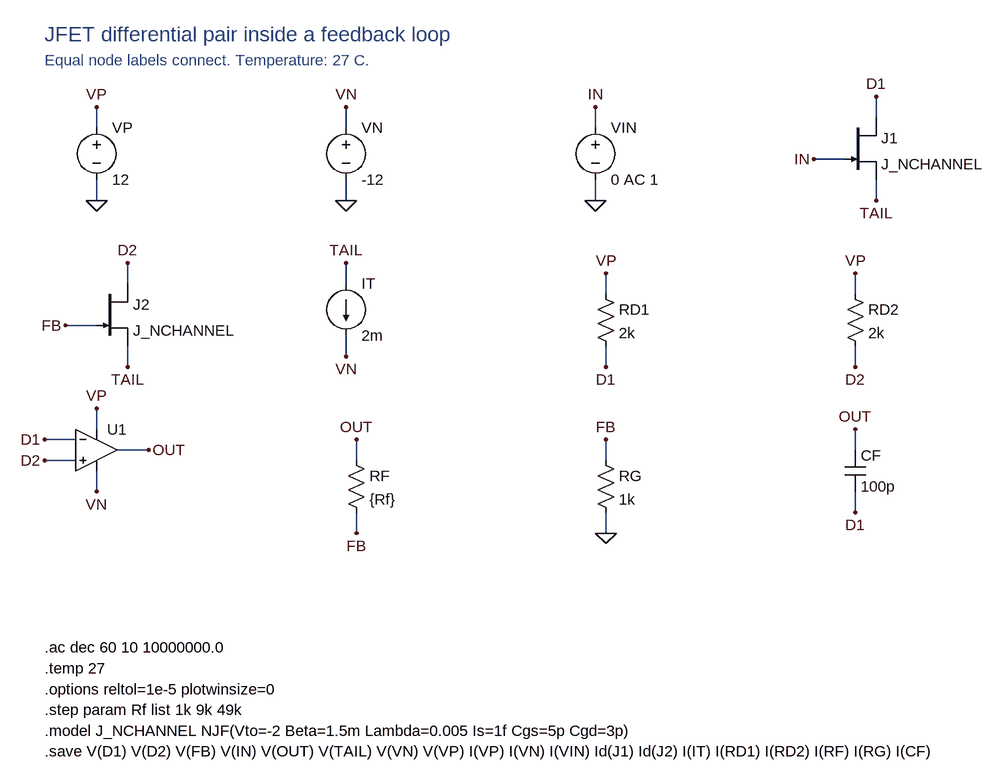
[diagram p0: schematic jfet-pair-feedback.asc]
jfet-pair-feedback.asc, the LTspice schematic file:
Version 4
SHEET 1 1740 1288
WIRE 144 176 144 144
WIRE 144 256 144 288
WIRE 528 176 528 144
WIRE 528 256 528 288
WIRE 912 176 912 144
WIRE 912 256 912 288
WIRE 1344 160 1344 128
WIRE 1296 224 1248 224
WIRE 1344 256 1344 288
WIRE 192 416 192 384
WIRE 144 480 96 480
WIRE 192 512 192 544
WIRE 528 416 528 384
WIRE 528 496 528 528
WIRE 928 432 928 400
WIRE 928 512 928 544
WIRE 1312 432 1312 400
WIRE 1312 512 1312 544
WIRE 112 688 64 688
WIRE 112 656 64 656
WIRE 144 640 144 608
WIRE 144 704 144 736
WIRE 176 672 224 672
WIRE 544 688 544 656
WIRE 544 768 544 800
WIRE 928 688 928 656
WIRE 928 768 928 800
WIRE 1312 672 1312 640
WIRE 1312 736 1312 768
FLAG 144 144 VP
FLAG 144 288 0
FLAG 528 144 VN
FLAG 528 288 0
FLAG 912 144 IN
FLAG 912 288 0
FLAG 1344 128 D1
FLAG 1248 224 IN
FLAG 1344 288 TAIL
FLAG 192 384 D2
FLAG 96 480 FB
FLAG 192 544 TAIL
FLAG 528 384 TAIL
FLAG 528 528 VN
FLAG 928 400 VP
FLAG 928 544 D1
FLAG 1312 400 VP
FLAG 1312 544 D2
FLAG 64 688 D2
FLAG 64 656 D1
FLAG 144 608 VP
FLAG 144 736 VN
FLAG 224 672 OUT
FLAG 544 656 OUT
FLAG 544 800 FB
FLAG 928 656 FB
FLAG 928 800 0
FLAG 1312 640 OUT
FLAG 1312 768 D1
SYMBOL voltage 144 160 R0
SYMATTR InstName VP
SYMATTR Value 12
SYMBOL voltage 528 160 R0
SYMATTR InstName VN
SYMATTR Value -12
SYMBOL voltage 912 160 R0
SYMATTR InstName VIN
SYMATTR Value 0 AC 1
SYMBOL njf 1296 160 R0
SYMATTR InstName J1
SYMATTR Value J_NCHANNEL
SYMBOL njf 144 416 R0
SYMATTR InstName J2
SYMATTR Value J_NCHANNEL
SYMBOL current 528 416 R0
SYMATTR InstName IT
SYMATTR Value 2m
SYMBOL res 912 416 R0
SYMATTR InstName RD1
SYMATTR Value 2k
SYMBOL res 1296 416 R0
SYMATTR InstName RD2
SYMATTR Value 2k
SYMBOL OpAmps/UniversalOpamp2 144 672 R0
SYMATTR InstName U1
SYMATTR SpiceModel level2
SYMATTR Value2 Avol=1Meg GBW=10Meg Slew=10Meg
SYMATTR SpiceLine Ilimit=100m Rail=0.5 Vos=0
SYMATTR SpiceLine2 En=0 Enk=0 In=0 Ink=0 Rin=1G
SYMBOL res 528 672 R0
SYMATTR InstName RF
SYMATTR Value {Rf}
SYMBOL res 912 672 R0
SYMATTR InstName RG
SYMATTR Value 1k
SYMBOL cap 1296 672 R0
SYMATTR InstName CF
SYMATTR Value 100p
TEXT 64 32 Left 3 ;JFET differential pair inside a feedback loop
TEXT 64 72 Left 2 ;Equal node labels connect. Temperature: 27 C.
TEXT 64 976 Left 2 !.ac dec 60 10 10000000.0
TEXT 64 1008 Left 2 !.temp 27
TEXT 64 1040 Left 2 !.options reltol=1e-5 plotwinsize=0
TEXT 64 1072 Left 2 !.step param Rf list 1k 9k 49k
TEXT 64 1104 Left 2 !.model J_NCHANNEL NJF(Vto=-2 Beta=1.5m Lambda=0.005 Is=1f Cgs=5p Cgd=3p)
TEXT 64 1136 Left 2 !.save V(D1) V(D2) V(FB) V(IN) V(OUT) V(TAIL) V(VN) V(VP) I(VP) I(VN) I(VIN) Id(J1) Id(J2) I(IT) I(RD1) I(RD2) I(RF) I(RG) I(CF)

The netlist it stands for:
* jfet-pair-feedback.asc
VP VP 0 12
VN VN 0 -12
VIN IN 0 0 AC 1
J1 D1 IN TAIL J_NCHANNEL
J2 D2 FB TAIL J_NCHANNEL
IT TAIL VN 2m
RD1 VP D1 2k
RD2 VP D2 2k
XU1 D2 D1 VP VN OUT level2 Avol=1Meg GBW=10Meg Slew=10Meg Ilimit=100m Rail=0.5 Vos=0 En=0 Enk=0 In=0 Ink=0 Rin=1G  ; pins In+ In- V+ V- OUT
RF OUT FB {Rf}
RG FB 0 1k
CF OUT D1 100p
.model NJF NJF
.model PJF PJF
.lib standard.jft
* JFET differential pair inside a feedback loop
* Equal node labels connect. Temperature: 27 C.
.ac dec 60 10 10000000.0
.temp 27
.options reltol=1e-5 plotwinsize=0
.step param Rf list 1k 9k 49k
.model J_NCHANNEL NJF(Vto=-2 Beta=1.5m Lambda=0.005 Is=1f Cgs=5p Cgd=3p)
.save V(D1) V(D2) V(FB) V(IN) V(OUT) V(TAIL) V(VN) V(VP) I(VP) I(VN) I(VIN) Id(J1) Id(J2) I(IT) I(RD1) I(RD2) I(RF) I(RG) I(CF)
.lib UniversalOpAmp2.lib
.backanno
.end